# EAGLE design basestation (EAGLE 6.6.0)
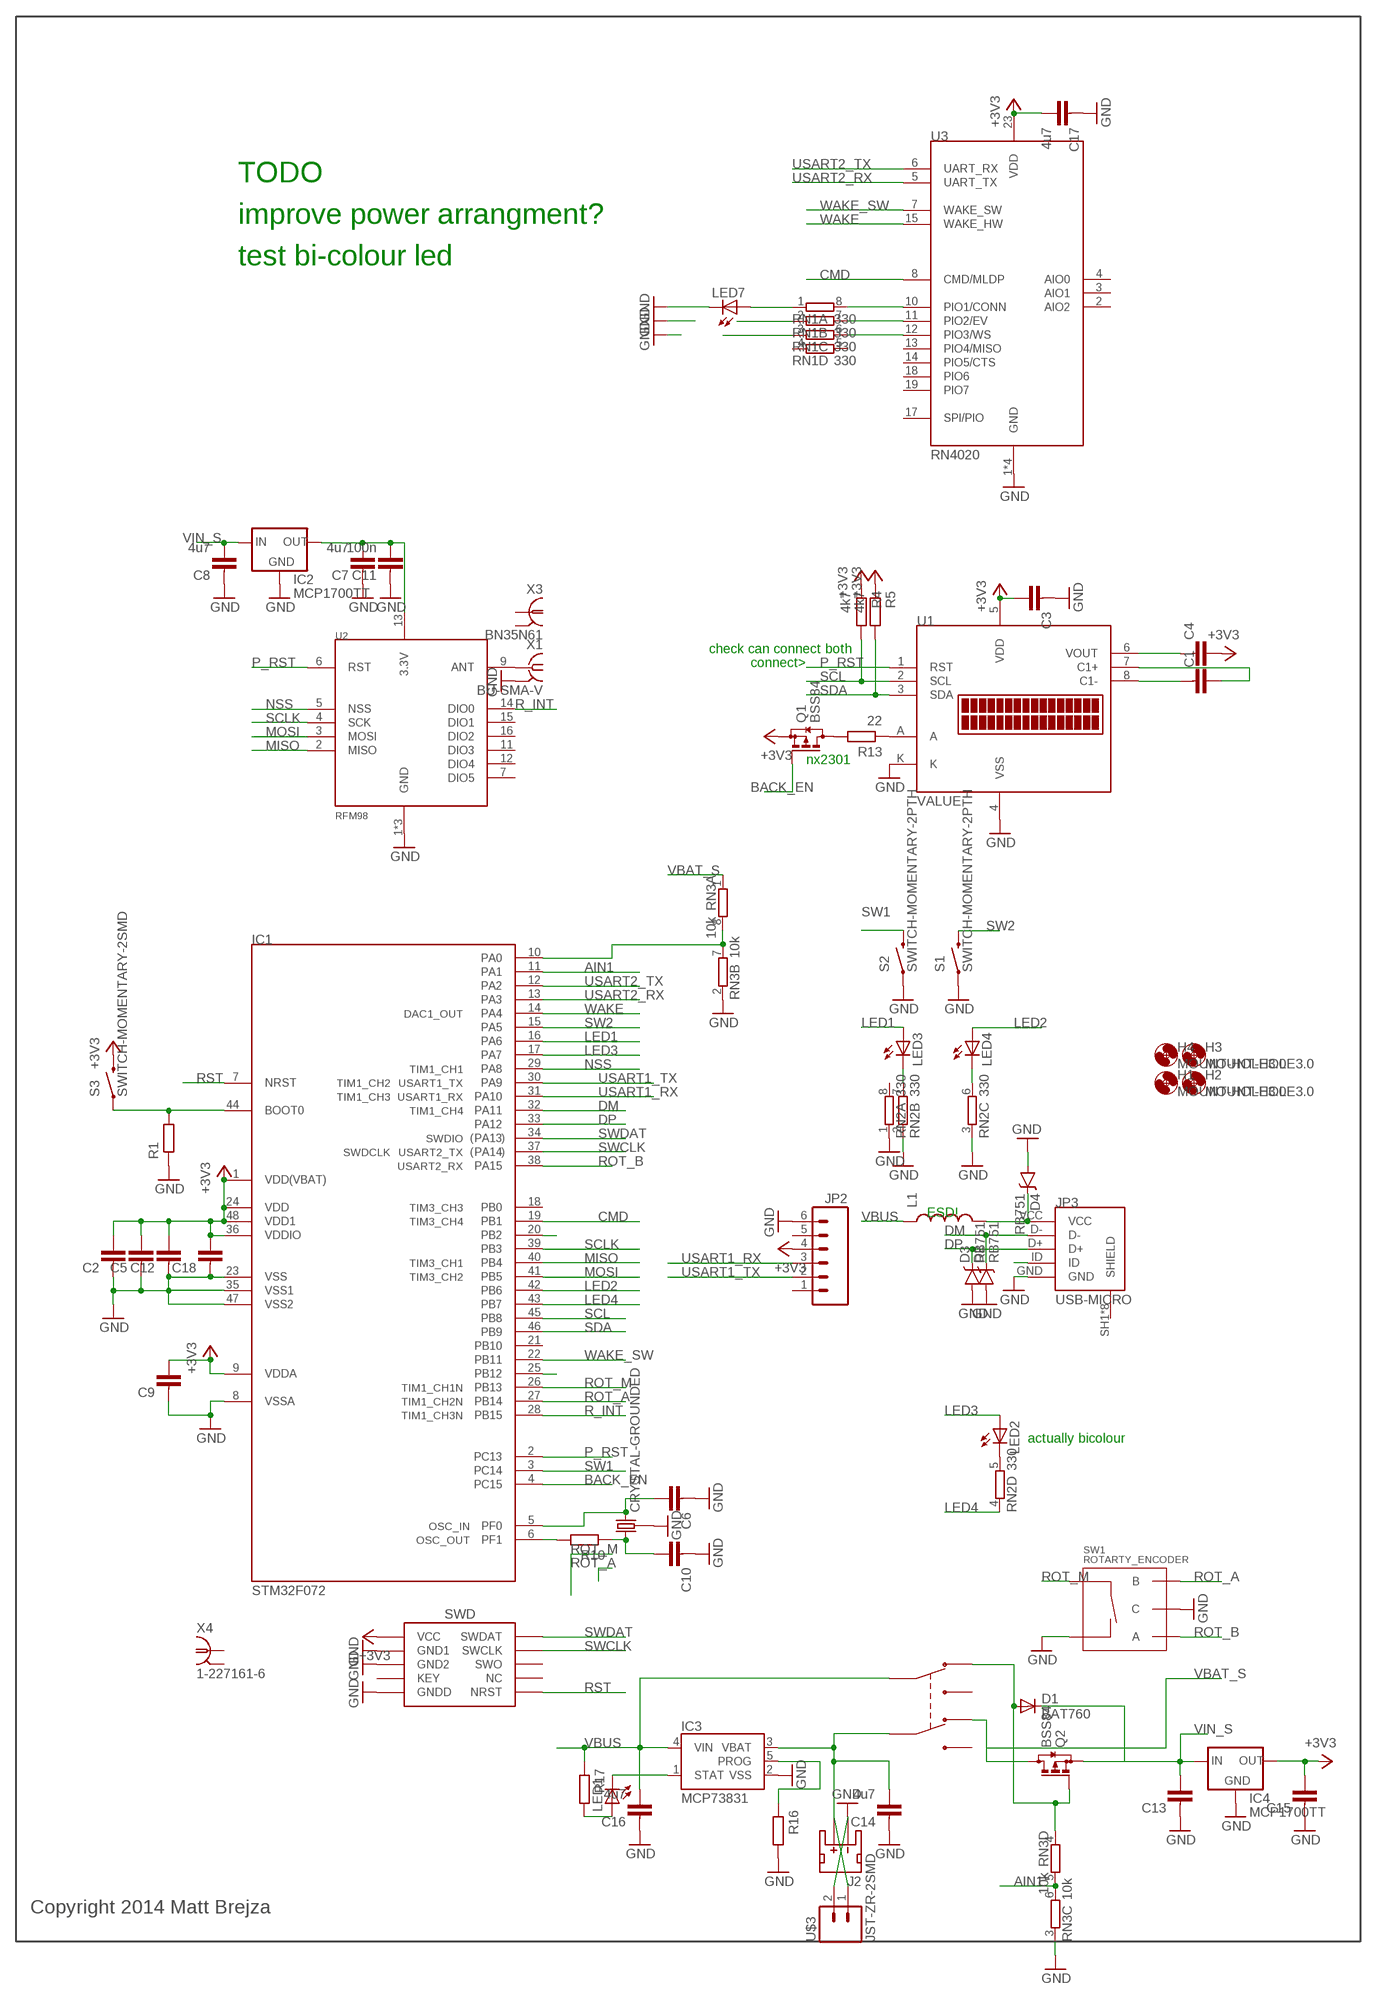
[diagram p0: schematic, sheet 1]

## Parts
C1  CAPACITOR0603-N  [C0603-N]
C2  CAPACITOR0603-N  [C0603-N]
C3  CAPACITOR0603-N  [C0603-N]
C4  CAPACITOR0603-N  [C0603-N]
C5  CAPACITOR0603-N  [C0603-N]
C6  CAPACITOR0603-N  [C0603-N]
C7  4u7  CAPACITOR0603-N  [C0603-N]
C8  4u7  CAPACITOR0603-N  [C0603-N]
C9  CAPACITOR0603-N  [C0603-N]
C10  CAPACITOR0603-N  [C0603-N]
C11  100n  CAPACITOR0603-N  [C0603-N]
C12  CAPACITOR0603-N  [C0603-N]
C13  CAPACITOR0603-N  [C0603-N]
C14  4u7  CAPACITOR0603-N  [C0603-N]
C15  CAPACITOR0603-N  [C0603-N]
C16  4u7  CAPACITOR0603-N  [C0603-N]
C17  4u7  CAPACITOR0603-N  [C0603-N]
C18  CAPACITOR0603-N  [C0603-N]
D1  BAT760  DIODE-SOD323-R  [SOD323-R]
D2  RB751  [SOD-523]
D3  RB751  [SOD-523]
D4  RB751  [SOD-523]
H1  MOUNT-HOLE3.0  [3,0]
H2  MOUNT-HOLE3.0  [3,0]
H3  MOUNT-HOLE3.0  [3,0]
H4  MOUNT-HOLE3.0  [3,0]
IC1  STM32F072  [TQFP48]
IC2  MCP1700TT  [SOT23]
IC3  MCP73831  [SOT23-5]
IC4  MCP1700TT  [SOT23]
J1  SWD_SHROUD_SMD  [SWD_SMD_SHROUD]
J2  JST_2MM_MALE  [JST-2-SMD]
JP2  M06SMD  [1X06-SMD]
JP3  USB-MICRO  [MOLEX_47589-0001]
L1  INDUCTOR0603  [0603]
LED1  LEDCHIP-LED0805  [CHIP-LED0805]
LED2  LED5MM  [LED5MM]
LED3  LED3MM  [LED3MM]
LED4  LED3MM  [LED3MM]
LED7  LEDCHIP-LED0805  [CHIP-LED0805]
Q1  BSS84  [SOT23]
Q2  BSS84  [SOT23]
R1  RESISTOR0603-N  [R0603-N]
R4  4k7  RESISTOR0603-N  [R0603-N]
R5  4k7  RESISTOR0603-N  [R0603-N]
R10  RESISTOR0603-N  [R0603-N]
R13  22  RESISTOR0603-N  [R0603-N]
R16  RESISTOR0603-N  [R0603-N]
R17  RESISTOR0603-N  [R0603-N]
RN1  330  4R-NEXB38V  [EXB38V]
RN2  330  4R-NEXB38V  [EXB38V]
RN3  10k  4R-NEXB38V  [EXB38V]
S1  SWITCH-MOMENTARY-2PTH  [TACTILE-PTH]
S2  SWITCH-MOMENTARY-2PTH  [TACTILE-PTH]
S3  SWITCH-MOMENTARY-2SMD  [TACTILE_SWITCH_SMD]
SW1  ROTARTY_ENCODER  [ROTARY_ENC_PLAIN]
U1  NHD-C0216CIZ-FSW  [NHD-C0216CIZ-FSW]
U2  RFM98  [RFM97]
U3  RN4020  [RN4020]
U$1  DPDTSLIDE  [DPDTSLIDE]
U$3  JST-ZR-2SMD  [JST-ZR-2-SMD]
X1  BU-SMA-V  [BU-SMA-V]
X2  CRYSTAL-GROUNDED  [CRYSTAL-SMD-5X3]
X3  BN35N61  [B35N61]
X4  1-227161-6  [AMP_227161]

## Nets
3.3V: C7.2 C11.2 IC2.2(OUT) U2.13(3.3V)
+3V3: C2.2 C3.2 C4.2 C5.2 C9.2 C12.2 C15.2 C17.2 C18.2 IC1.1(VDD(VBAT)) IC1.9(VDDA) IC1.24(VDD) IC1.36(VDDIO) IC1.48(VDD1) IC4.2(OUT) J1.1(VCC) JP2.4 Q1.2(S) R4.1 R5.1 S3.3 U1.5(VDD) U3.23(VDD)
AIN1: IC1.11(PA1) RN3.5 RN3.6
BACK_EN: IC1.4(PC15) Q1.1(G)
CMD: IC1.19(PB1) U3.8(CMD/MLDP)
DM: D2.C IC1.32(PA11) JP3.D-
DP: D3.C IC1.33(PA12) JP3.D+
GND: C2.1 C3.1 C5.1 C6.1 C7.1 C8.1 C9.1 C10.1 C11.1 C12.1 C13.1 C14.1 C15.1 C16.1 C17.1 C18.1 D2.A D3.A D4.A IC1.8(VSSA) IC1.23(VSS) IC1.35(VSS1) IC1.47(VSS2) IC2.1(GND) IC3.2(VSS) IC4.1(GND) J1.3(GND1) J1.5(GND2) J1.9(GNDD) J2.1(-) JP2.6 JP3.GND LED7.C R1.1 R16.2 RN2.1 RN2.2 RN2.3 RN3.2 RN3.3 S1.1 S2.1 SW1.C SW1.SW- U1.4(VSS) U1.K U2.1(GND) U2.8(GND) U2.10(GND) U3.1(GND) U3.9(GND) U3.16(GND) U3.24(GND) U$3.2 X1.2 X1.3 X1.4 X1.5 X2.2 X2.4
LED1: IC1.16(PA6) LED3.A
LED2: IC1.42(PB6) LED4.A
LED3: IC1.17(PA7) LED2.A
LED4: IC1.43(PB7) RN2.4
MISO: IC1.40(PB4) U2.2(MISO)
MOSI: IC1.41(PB5) U2.3(MOSI)
N$1: U2.9(ANT) X1.1
N$3: Q1.3(D) R13.2
N$4: IC1.44(BOOT0) R1.2 S3.1
N$5: RN1.8 U3.10(PIO1/CONN)
N$6: LED3.K(C) RN2.7
N$7: IC3.5(PROG) R16.1
N$8: C1.1 U1.8(C1-)
N$9: C1.2 U1.7(C1+)
N$10: LED4.K(C) RN2.6
N$11: LED2.K(C) RN2.5
N$12: C4.1 U1.6(VOUT)
N$13: RN1.7 U3.11(PIO2/EV)
N$14: RN1.6 U3.12(PIO3/WS)
N$15: LED7.A RN1.1
N$16: RN1.2
N$17: RN1.3
N$21: IC1.25(PB12)
N$23: R13.1 U1.A
N$25: IC1.20(PB2)
N$26: D1.A Q2.1(G) RN3.4 U$1.1A(NC0)
N$27: IC1.10(PA0) RN3.7 RN3.8
N$28: JP3.ID
N$29: IC3.1(STAT) LED1.C
N$30: IC1.6(PF1) R10.2
N$31: C6.2 IC1.5(PF0) X2.1
N$32: C10.2 R10.1 X2.3
N$33: C14.2 IC3.3(VBAT) J2.2(+) U$1.2X(COM1) U$3.1
N$34: LED1.A R17.2
N$35: D4.C JP3.VCC L1.2
NSS: IC1.29(PA8) U2.5(NSS)
P_RST: IC1.2(PC13) U1.1(RST) U2.6(RST)
R_INT: IC1.28(PB15) U2.14(DIO0)
ROT_A: IC1.27(PB14) SW1.B
ROT_B: IC1.38(PA15) SW1.A
ROT_M: IC1.26(PB13) SW1.SW+
RST: IC1.7(NRST) J1.10(NRST)
SCL: IC1.45(PB8) R4.2 U1.2(SCL)
SCLK: IC1.39(PB3) U2.4(SCK)
SDA: IC1.46(PB9) R5.2 U1.3(SDA)
SW1: IC1.3(PC14) S2.3
SW2: IC1.15(PA5) S1.3
SWCLK: IC1.37(PA14) J1.4(SWCLK)
SWDAT: IC1.34(PA13) J1.2(SWDAT)
USART1_RX: IC1.31(PA10) JP2.3
USART1_TX: IC1.30(PA9) JP2.2
USART2_RX: IC1.13(PA3) U3.5(UART_TX)
USART2_TX: IC1.12(PA2) U3.6(UART_RX)
VBAT_S: Q2.3(D) RN3.1 U$1.2A(NC1)
VBUS: C16.2 IC3.4(VIN) L1.1 R17.1 U$1.1X(COM0)
VIN_S: C8.2 C13.2 D1.C IC2.3(IN) IC4.3(IN) Q2.2(S)
WAKE: IC1.14(PA4) U3.15(WAKE_HW)
WAKE_SW: IC1.22(PB11) U3.7(WAKE_SW)
Unconnected: IC1.18(PB0) IC1.21(PB10) J1.6(SWO) J1.7(KEY) J1.8(NC) J2.NC1(PAD1) J2.NC2(PAD2) JP2.1 JP2.5 JP3.SH1(SHIELD) JP3.SH2(SHIELD) JP3.SH3(SHIELD) JP3.SH4(SHIELD) JP3.SH5(SHIELD) JP3.SH6(SHIELD) JP3.SH7(SHIELD) JP3.SH8(SHIELD) RN1.4 RN1.5 RN2.8 U2.7(DIO5) U2.11(DIO3) U2.12(DIO4) U2.15(DIO1) U2.16(DIO2) U3.2(AIO2) U3.3(AIO1) U3.4(AIO0) U3.13(PIO4/MISO) U3.14(PIO5/CTS) U3.17(SPI/PIO) U3.18(PIO6) U3.19(PIO7) U$1.1B(NO0) U$1.2B(NO1) X3.1 X3.2 X3.3 X3.4 X3.5 X4.1 X4.2

## Notes on the sheet
- TODO
- improve power arrangment?
- test bi-colour led
- check can connect both
- connect>
- nx2301
- ESD!
- actually bicolour
- Copyright 2014 Matt Brejza

## Library data of the parts
C1-C18 = passives-7351:CAPACITOR
D1 = dtb:DIODE-: DIODE
D2-D4 = SparkFun-DiscreteSemi:RB751: 40V 120mA SOD-523 Schottky DIO-11018; PROD_ID: DIO-11018
H1-H4 = Mounting:MOUNT-HOLE: MOUNTING HOLE with drill center marker
IC1 = dtb:STM32F072
IC2 IC4 = dtb:MCP1700
IC3 = SparkFun-PowerIC:MCP73831: Miniature single cell, fully integrated Li-Ion, Li-polymer charge management controller http://ww1.microchip.com/downloads/en/DeviceDoc/21984a.pdf IC-09995; PROD_ID: IC-09995
J1 = dtb:SWD_SHROUD
J2 = dtb:JST_2MM_MALE: Mates to single-cell LiPo batteries. CONN-08352; PROD_ID: CONN-08352
JP2 = SparkFun-Connectors:M06: Header 6 Standard 6-pin 0.1" header. Use with straight break away headers (SKU : PRT-00116), right angle break away headers (PRT-00553), swiss pins (PRT-00743), machine pins (PRT-00117), and female headers (PRT-00115). Molex polarized connector foot print use with SKU : PRT-08094 with associated crimp pins and housings. NOTES ON THE VARIANTS LOCK and LOCK_LONGPADS... This footprint was designed to help hold the alignment of a through-hole component (i.e. 6-pin header) while soldering it into place. You may notice that each hole has been shifted either up or down by 0.005 of an inch from it's more standard position (which is a perfectly straight line). This slight alteration caused the pins (the squares in the middle) to touch the edges of the holes. Because they are alternating, it causes a "brace" to hold the component in place. 0.005 has proven to be the perfect amount of "off-center" position when using our standard breakaway headers. Although looks a little odd when you look at the bare footprint, once you have a header in there, the alteration is very hard to notice. Also,if you push a header all the way into place, it is covered up entirely on the bottom side. This idea of altering the position of holes to aid alignment will be further integrated into the Sparkfun Library for other footprints. It can help hold any component with 3 or more connection pins.
JP3 = Mine:USB-MICRO
L1 = SparkFun-Passives:INDUCTOR: Inductors Basic Inductor/Choke - 0603 and 1206. Footprints are not proven and vary greatly between part numbers. SRN6045- 33uH, 20% 1.4A SDR0403-560KL - 56uH, 10%, 500mA RMS/740mA peak
LED1 LED2 LED7 = led:LED: LED OSRAM: - CHIPLED LG R971, LG N971, LY N971, LG Q971, LY Q971, LO R971, LY R971 LH N974, LH R974 LS Q976, LO Q976, LY Q976 LO Q996 - Hyper CHIPLED LW Q18S LB Q993, LB Q99A, LB R99A - SideLED LS A670, LO A670, LY A670, LG A670, LP A670 LB A673, LV A673, LT A673, LW A673 LH A674 LY A675 LS A676, LA A676, LO A676, LY A676, LW A676 LS A679, LY A679, LG A679 - Hyper Micro SIDELED® LS Y876, LA Y876, LO Y876, LY Y876 LT Y87S - SmartLED LW L88C, LW L88S LB L89C, LB L89S, LG L890 LS L89K, LO L89K, LY L89K LS L896, LA L896, LO L896, LY L896 - TOPLED LS T670, LO T670, LY T670, LG T670, LP T670 LSG T670, LSP T670, LSY T670, LOP T670, LYG T670 LG T671, LOG T671, LSG T671 LB T673, LV T673, LT T673, LW T673 LH T674 LS T676, LA T676, LO T676, LY T676, LB T676, LH T676, LSB T676, LW T676 LB T67C, LV T67C, LT T67C, LS T67K, LO T67K, LY T67K, LW E67C LS E67B, LA E67B, LO E67B, LY E67B, LB E67C, LV E67C, LT E67C LW T67C LS T679, LY T679, LG T679 LS T770, LO T770, LY T770, LG T770, LP T770 LB T773, LV T773, LT T773, LW T773 LH T774 LS E675, LA E675, LY E675, LS T675 LS T776, LA T776, LO T776, LY T776, LB T776 LHGB T686 LT T68C, LB T68C - Hyper Mini TOPLED® LB M676 - Mini TOPLED Santana® LG M470 LS M47K, LO M47K, LY M47K Source: http://www.osram.convergy.de LUXEON: - LUMILED® LXK2-PW12-R00, LXK2-PW12-S00, LXK2-PW14-U00, LXK2-PW14-V00 LXK2-PM12-R00, LXK2-PM12-S00, LXK2-PM14-U00 LXK2-PE12-Q00, LXK2-PE12-R00, LXK2-PE12-S00, LXK2-PE14-T00, LXK2-PE14-U00 LXK2-PB12-K00, LXK2-PB12-L00, LXK2-PB12-M00, LXK2-PB14-N00, LXK2-PB14-P00, LXK2-PB14-Q00 LXK2-PR12-L00, LXK2-PR12-M00, LXK2-PR14-Q00, LXK2-PR14-R00 LXK2-PD12-Q00, LXK2-PD12-R00, LXK2-PD12-S00 LXK2-PH12-R00, LXK2-PH12-S00 LXK2-PL12-P00, LXK2-PL12-Q00, LXK2-PL12-R00 Source: www.luxeon.com KINGBRIGHT: KA-3528ASYC Source: www.kingbright.com
LED3 LED4 = dtb:LED: LED OSRAM: - CHIPLED LG R971, LG N971, LY N971, LG Q971, LY Q971, LO R971, LY R971 LH N974, LH R974 LS Q976, LO Q976, LY Q976 LO Q996 - Hyper CHIPLED LW Q18S LB Q993, LB Q99A, LB R99A - SideLED LS A670, LO A670, LY A670, LG A670, LP A670 LB A673, LV A673, LT A673, LW A673 LH A674 LY A675 LS A676, LA A676, LO A676, LY A676, LW A676 LS A679, LY A679, LG A679 - Hyper Micro SIDELED® LS Y876, LA Y876, LO Y876, LY Y876 LT Y87S - SmartLED LW L88C, LW L88S LB L89C, LB L89S, LG L890 LS L89K, LO L89K, LY L89K LS L896, LA L896, LO L896, LY L896 - TOPLED LS T670, LO T670, LY T670, LG T670, LP T670 LSG T670, LSP T670, LSY T670, LOP T670, LYG T670 LG T671, LOG T671, LSG T671 LB T673, LV T673, LT T673, LW T673 LH T674 LS T676, LA T676, LO T676, LY T676, LB T676, LH T676, LSB T676, LW T676 LB T67C, LV T67C, LT T67C, LS T67K, LO T67K, LY T67K, LW E67C LS E67B, LA E67B, LO E67B, LY E67B, LB E67C, LV E67C, LT E67C LW T67C LS T679, LY T679, LG T679 LS T770, LO T770, LY T770, LG T770, LP T770 LB T773, LV T773, LT T773, LW T773 LH T774 LS E675, LA E675, LY E675, LS T675 LS T776, LA T776, LO T776, LY T776, LB T776 LHGB T686 LT T68C, LB T68C - Hyper Mini TOPLED® LB M676 - Mini TOPLED Santana® LG M470 LS M47K, LO M47K, LY M47K Source: http://www.osram.convergy.de LUXEON: - LUMILED® LXK2-PW12-R00, LXK2-PW12-S00, LXK2-PW14-U00, LXK2-PW14-V00 LXK2-PM12-R00, LXK2-PM12-S00, LXK2-PM14-U00 LXK2-PE12-Q00, LXK2-PE12-R00, LXK2-PE12-S00, LXK2-PE14-T00, LXK2-PE14-U00 LXK2-PB12-K00, LXK2-PB12-L00, LXK2-PB12-M00, LXK2-PB14-N00, LXK2-PB14-P00, LXK2-PB14-Q00 LXK2-PR12-L00, LXK2-PR12-M00, LXK2-PR14-Q00, LXK2-PR14-R00 LXK2-PD12-Q00, LXK2-PD12-R00, LXK2-PD12-S00 LXK2-PH12-R00, LXK2-PH12-S00 LXK2-PL12-P00, LXK2-PL12-Q00, LXK2-PL12-R00 Source: www.luxeon.com KINGBRIGHT: KA-3528ASYC Source: www.kingbright.com
Q1 Q2 = transistor-small-signal:BSS84: P-CHANNEL MOS FET
R1 R4 R5 R10 R13 R16 R17 = passives-7351:RESISTOR
RN1-RN3 = resistor-dil:4R-N: Array Chip Resistor Source: RS Component / Phycomp; OC_FARNELL: unknown; OC_NEWARK: unknown
S1-S3 = Mine:SWITCH-MOMENTARY-2: Various NO switches- pushbuttons, reed, etc
SW1 = SparkFun-Electromechanical:ROTARTY_ENCODER: Simple no LED rotary encoder Example: COM-09117
U1 = dtb:NHD-C0216CIZ-FSW
U2 = Mine:RFM98
U3 = Mine:RN4020
U$1 = Mine:DPDTSLIDE
U$3 = Mine:JST-ZR-2
X1 = con-coax:BU-SMA-V: FEMALE SMA CONNECTOR Radiall distributor RS 112-3794; OC_FARNELL: unknown; OC_NEWARK: unknown
X2 = SparkFun-FreqCtrl:CRYSTAL-GROUNDED
X3 = con-coax:BN35N61: BNC CONNECTOR M/A COM www.macom.com distributor Farnell 149-452; OC_FARNELL: unknown; OC_NEWARK: unknown
X4 = con-coax:?227161*: JACK, RIGHT ANGLE, 50 OHM, PCB, BNC Source: amp_227161.pdf; MF: TYCO ELECTRONICS; MPN: 1-227161-6; OC_FARNELL: unknown; OC_NEWARK: 09H7854

## Board
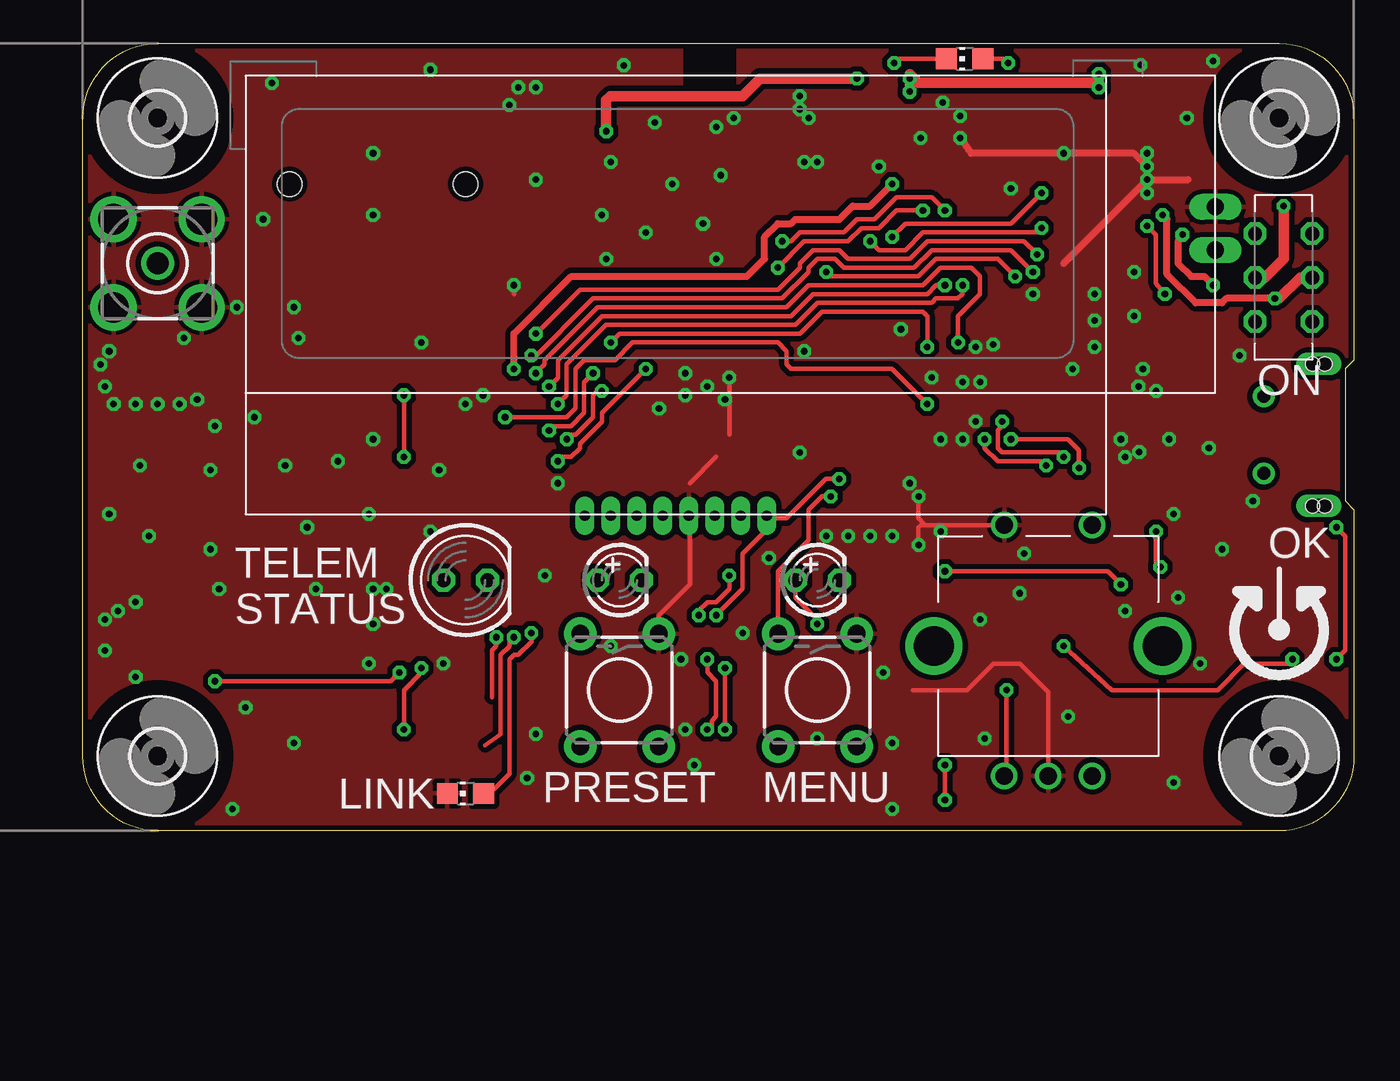
[diagram p1: board, top side]
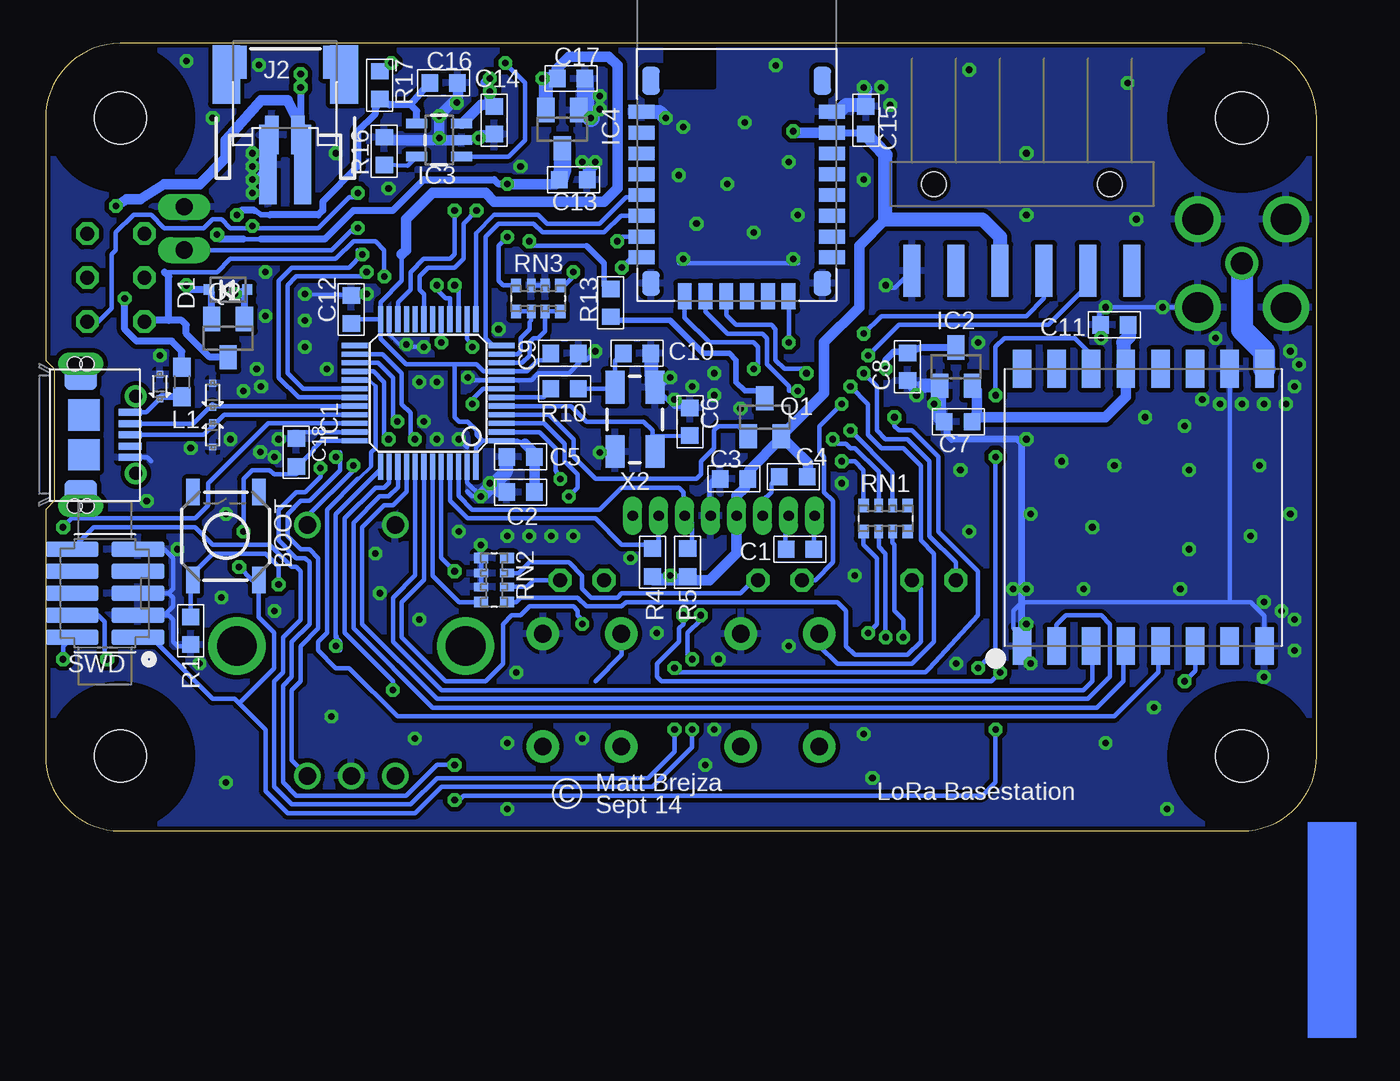
[diagram p2: board, bottom side, seen from below]

Size 73.41 x 45.47 mm. Coordinates in mm from the lower left corner, seen from the top.
Outline: 4.32,45.47 69.09,45.47 arc-90 73.41,41.15 73.41,27.18 72.9,26.67 72.9,19.05 73.41,18.54 73.41,4.32 arc-90 69.09,0 4.32,0 arc-90 0,4.32 0,41.15 arc-90 4.32,45.47
Copper layers (1*16): Top 0.035mm / dielectric 1.5mm / Bottom 0.035mm
Design rules "default *": minimum track width 0.2mm, minimum drill 15mil, track to track 8mil, track to pad 8mil, pad to pad 6mil, via to via 8mil, smd to smd 6mil, copper to edge 10mil, drill to drill 8mil, minimum pad ring 10mil, minimum via ring 8mil, stop-mask expansion 4mil, vias tented up to drill 15mil, thermal gap 10mil
tKeepout: area 35.1,43.2 to 37.3,45

### Footprints (pad centres in the part's own frame; a part is rotated, then mirrored left to right if it is on the bottom)
C0603-N = smd 0.95 x 1: 1 -0.8,0; 2 0.8,0
SOD323-R = smd 0.6 x 0.6: A 1.1,0; C -1.1,0
SOD-523 = smd 0.4 x 0.4: A -0.7,0; C 0.7,0
3,0 = hole 3: 0,0
TQFP48 = smd 0.3 x 1.5: 1 -2.75,-4.25; 2 -2.25,-4.25; 3 -1.75,-4.25; 4 -1.25,-4.25; 5 -0.75,-4.25; 6 -0.25,-4.25; 7 0.25,-4.25; 8 0.75,-4.25; 9 1.25,-4.25; 10 1.75,-4.25; 11 2.25,-4.25; 12 2.75,-4.25; 25 2.75,4.25; 26 2.25,4.25; 27 1.75,4.25; 28 1.25,4.25; 29 0.75,4.25; 30 0.25,4.25; 31 -0.25,4.25; 32 -0.75,4.25; 33 -1.25,4.25; 34 -1.75,4.25; 35 -2.25,4.25; 36 -2.75,4.25 | smd 1.5 x 0.3: 13 4.25,-2.75; 14 4.25,-2.25; 15 4.25,-1.75; 16 4.25,-1.25; 17 4.25,-0.75; 18 4.25,-0.25; 19 4.25,0.25; 20 4.25,0.75; 21 4.25,1.25; 22 4.25,1.75; 23 4.25,2.25; 24 4.25,2.75; 37 -4.25,2.75; 38 -4.25,2.25; 39 -4.25,1.75; 40 -4.25,1.25; 41 -4.25,0.75; 42 -4.25,0.25; 43 -4.25,-0.25; 44 -4.25,-0.75; 45 -4.25,-1.25; 46 -4.25,-1.75; 47 -4.25,-2.25; 48 -4.25,-2.75
SOT23 = smd 1 x 1.4: 1 -0.95,-1.1; 2 0.95,-1.1; 3 0,1.1
SOT23-5 = smd 0.55 x 1.2: 1 -0.95,-1.3; 2 0,-1.3; 3 0.95,-1.3; 4 0.95,1.3; 5 -0.95,1.3
SWD_SMD_SHROUD = smd 0.914 x 3.048: 1 -2.54,-1.905; 2 -2.54,1.905; 3 -1.27,-1.905; 4 -1.27,1.905; 5 0,-1.905; 6 0,1.905; 7 1.27,-1.905; 8 1.27,1.905; 9 2.54,-1.905; 10 2.54,1.905
JST-2-SMD = smd 1 x 4.6: 1 -1,-3.7; 2 1,-3.7 | smd 1.6 x 3.4: NC1 -3.4,1.5; NC2 3.4,1.5
1X06-SMD = smd 1 x 3: 1 -6.35,5; 2 -3.81,5; 3 -1.27,5; 4 1.27,5; 5 3.81,5; 6 6.35,5 | hole 1.4: -5.08,0; 5.08,0
MOLEX_47589-0001 = smd 1.35 x 0.4: D+ 2.855,0; D- 2.855,0.652; GND 2.855,-1.3; ID 2.855,-0.65; VCC 2.855,1.3 | smd 1.8 x 1.8: SH1 0.18,1.15; SH2 0.18,-1.15 | drill 0.75 pad 1.15: SH3 3.18,-2.225; SH4 3.18,2.225 | smd 1.9 x 2.1: SH5 0,3.65; SH6 0,-3.65 | drill 0.8 pad 1.2 long: SH7 0,-4.1; SH8 0,4.1 | hole 0.8: -0.35,-4.1; 0.35,-4.1; -0.35,4.1; 0.35,4.1
0603 = smd 1.1 x 1: 1 -0.85,0; 2 0.85,0
CHIP-LED0805 = smd 1.2 x 1.2: A 0,-1.05; C 0,1.05
LED5MM = drill 0.813 octagon: A -1.27,0; K 1.27,0
LED3MM = drill 0.813 octagon: A -1.27,0; K 1.27,0
R0603-N = smd 0.95 x 1: 1 -0.8,0; 2 0.8,0
EXB38V = smd 0.6 x 0.8: 1 -1.275,-0.75; 4 1.275,-0.75; 5 1.275,0.75; 8 -1.275,0.75 | smd 0.5 x 0.8: 2 -0.4,-0.75; 3 0.4,-0.75; 6 0.4,0.75; 7 -0.4,0.75
TACTILE-PTH = drill 1.016 pad 1.88: 1 -3.251,2.261; 2 3.251,2.261; 3 -3.251,-2.261; 4 3.251,-2.261
TACTILE_SWITCH_SMD = smd 1.524 x 0.762: 1 -2.54,1.905; 2 2.54,1.905; 3 -2.54,-1.905; 4 2.54,-1.905
ROTARY_ENC_PLAIN = drill 1.016: A 7.493,-2.54; B 7.493,2.54; C 7.493,0; SW+ -6.985,2.54; SW- -6.985,-2.54 | drill 2.286: P$3 0,6.604; P$4 0,-6.604
NHD-C0216CIZ-FSW = drill 0.6 long: 1 30.1,-0.1; 2 28.6,-0.1; 3 27.1,-0.1; 4 25.6,-0.1; 5 24.1,-0.1; 6 22.6,-0.1; 7 21.1,-0.1; 8 19.6,-0.1 | drill 1 pad 1.27 long: A 56,15.24; K 56,17.74
RFM97 = smd 2.184 x 1.067: 1 0,0; 2 0,-2; 3 0,-4; 4 0,-6; 5 0,-8; 6 0,-10; 7 0,-12; 8 0,-14; 9 16,-14; 10 16,-12; 11 16,-10; 12 16,-8; 13 16,-6; 14 16,-4; 15 16,-2; 16 16,0
RN4020 = smd 1.5 x 0.8: 1 0.25,10.9; 2 0.25,9.7; 3 0.25,8.5; 4 0.25,7.3; 5 0.25,6.1; 6 0.25,4.9; 7 0.25,3.7; 8 0.25,2.5; 17 11.25,2.5; 18 11.25,3.7; 19 11.25,4.9; 20 11.25,6.1; 21 11.25,7.3; 22 11.25,8.5; 23 11.25,9.7; 24 11.25,10.9 | smd 1 x 1.4: 9 0.8,1; 16 10.7,1 | smd 0.8 x 1.5: 10 2.75,0.25; 11 3.95,0.25; 12 5.15,0.25; 13 6.35,0.25; 14 7.55,0.25; 15 8.75,0.25 | smd 1 x 1.6: S1 0.8,12.7; S2 10.7,12.7
DPDTSLIDE = drill 0.8 octagon: 1A -2.54,0; 1B 2.54,0; 1X 0,0; 2A -2.54,3.3; 2B 2.54,3.3; 2X 0,3.3
JST-ZR-2-SMD = smd 0.8 x 2.2: 1 0.6,-1.1; 2 -0.9,-1.1 | smd 1.1 x 1.9: TB1 -2.9,3.1; TB2 2.6,3.1
BU-SMA-V = drill 1.27: 1 0,0 | drill 1.778: 2 -2.55,2.55; 3 2.55,2.55; 4 2.55,-2.55; 5 -2.55,-2.55
CRYSTAL-SMD-5X3 = smd 1.9 x 1.1: 1 -1.85,-1.15; 2 1.85,-1.15; 3 1.85,1.15; 4 -1.85,1.15
B35N61 = drill 1.2: 1 0,0 | drill 1.3: 2 3.099,3.099; 3 -3.099,3.099; 4 -3.099,-3.099; 5 3.099,-3.099
AMP_227161 = drill 0.9 pad 1.27: 1 0,-5.08; 2 -2.54,-5.08 | hole 2: -5.08,0; 5.08,0

### Placement (x,y rotation side)
C1  29.84,16.26 180 bottom
C2  45.97,19.56 0 bottom
C3  33.66,20.32 0 bottom
C4  30.23,20.45 0 bottom
C5  45.97,21.59 0 bottom
C6  36.2,23.62 270 bottom
C7  20.7,23.62 0 bottom
C8  23.62,26.8 90 bottom
C9  43.43,27.56 180 bottom
C10  39.24,27.56 180 bottom
C11  11.68,29.21 0 bottom
C12  55.75,30.1 270 bottom
C13  42.93,37.59 180 bottom
C14  47.5,41.02 90 bottom
C15  26.04,41.02 270 bottom
C16  50.42,43.18 180 bottom
C17  43.05,43.43 180 bottom
C18  58.93,21.84 270 bottom
D1  62.87,31.24 0 bottom
D2  63.75,25.15 270 bottom
D3  63.75,22.86 90 bottom
D4  66.8,25.65 270 bottom
H1  4.32,41.15 0 top
H2  69.09,41.15 0 top
H3  4.32,4.32 0 top
H4  69.09,4.32 0 top
IC1  51.31,25.27 90 bottom
IC2  20.83,26.8 0 bottom
IC3  50.67,39.88 90 bottom
IC4  43.56,40.51 180 bottom
J1  69.98,13.72 90 bottom
J2  59.56,42.16 0 bottom
JP2  17.02,37.34 180 bottom
JP3  71.37,22.86 0 bottom
L1  65.53,25.91 270 bottom
LED1  50.93,44.58 90 top
LED2  22.1,14.48 0 top
LED3  30.99,14.48 0 top
LED4  42.42,14.48 0 top
LED7  22.1,2.16 90 top
Q1  31.88,23.88 0 bottom
Q2  62.87,28.45 180 bottom
R1  65.02,11.56 90 bottom
R4  38.35,15.49 90 bottom
R5  36.32,15.49 90 bottom
R10  43.43,25.53 180 bottom
R13  40.77,30.48 270 bottom
R16  53.85,39.24 90 bottom
R17  54.1,43.05 90 bottom
RN1  24.89,18.03 0 bottom
RN2  47.5,14.48 270 bottom
RN3  44.96,30.73 180 bottom
S1  30.99,8.13 270 top
S2  42.42,8.13 270 top
S3  62.99,17.02 90 bottom
SW1  55.75,10.67 270 top
U1  9.4,18.29 0 top
U2  17.02,10.67 90 bottom
U3  39.24,30.61 0 bottom
U$1  70.99,31.94 90 top
U$3  59.44,41.28 0 bottom
X1  4.32,32.77 0 top
X2  39.37,23.75 90 bottom
X3  -22.35,4.83 0 top  (outside the outline)
X4  -47.75,-2.54 0 top  (outside the outline)

### Tracks (layer width: path | path; a pad name or v marks a point on that pad's centre or on a via)
3.3V
  Bottom 0.254: IC2.2 19.62,25.4 19.88,23.65 C7.2
  Bottom 0.61: U2.13 11.02,25.05 12.19,23.88 19.62,23.88 19.62,25.4
  Bottom 0.813: C11.2 10.83,28.54 11.18,28.19 11.18,26.83 U2.13
+3V3  (via drill 0.38)
  Top 0.254: v36.07,9.91 36.07,9.14 36.58,8.64 36.58,6.6 36.32,6.35 36.32,6.1 v36.07,5.84 | v35.56,12.45 35.56,12.7 36.07,13.21 36.58,13.21 37.34,13.97 v37.34,14.73 | v61.98,17.27 61.98,15.49 v62.23,15.24
  Top 0.61: v30.23,40.39 30.23,42.16 30.48,42.42 38.1,42.42 39.12,43.43 v44.7,43.43
  Bottom 0.254: 44.96,20.92 C5.2 | C9.2 44.66,27.18 44.96,27.18 45.61,26.52 IC1.9 48.11,26.52 48.51,26.92 49.78,26.92 | C15.2 26.04,40.01 25.91,40.13 | IC1.24 55.73,29.52 C12.2 | 49.78,26.92 52.58,26.92 54.06,28.4 IC1.24 | 48.18,22.52 IC1.1 46.15,22.52 45.72,22.35 | 48.18,22.52 48.51,22.86 48.51,23.11 49.02,23.62 49.53,23.62 49.78,23.88 49.78,26.92 | IC1.48 48.56,22.14 48.18,22.52 | R4.1 38.35,14.73 v37.34,14.73 36.32,14.73 | v36.07,5.84 36.07,4.83 38.35,2.54 50.55,2.54 52.07,1.02 59.44,1.02 60.71,2.29 60.71,5.84 62.23,7.37 | 62.23,7.37 62.48,7.62 63.75,7.62 67.31,11.18 J1.1 | 36.11,14.73 R5.1 | C4.2 29.38,20.49 | v35.56,12.45 35.56,12.19 36.32,11.43 36.32,10.16 v36.07,9.91 | IC1.24 54.06,30.52 52.83,31.75 52.83,33.27 | 62.23,7.37 60.2,9.4 60.2,11.43 61.09,12.32 S3.3 61.47,14.48 v62.23,15.24 62.23,14.99 | 57.91,22.1 57.91,22.06 | IC1.36 57.45,22.52 57.91,22.06 | 57.91,22.06 57.91,21.97 58.67,21.21 | 58.67,21.21 58.93,20.57 60.2,20.57 60.45,20.83 61.47,20.83 61.98,20.32 v61.98,17.27 | C18.2 58.89,21.04 58.67,21.21
  Bottom 0.406: R5.1 36.32,14.73 | U3.23 26.17,40.31 C15.2
  Bottom 0.61: U3.23 30.15,40.31 v30.23,40.39 | 24.89,35.31 26.42,33.78 26.42,30.23 28.45,28.19 28.45,25.25 Q1.2 | Q1.2 30.93,22.67 32.77,20.83 32.77,20.36 C3.2 33.02,20.11 33.02,19.81 33.5,19.33 U1.5 33.5,16.03 35.05,14.48 38.32,14.48 R4.1 | 29.38,20.49 29.38,21.25 29.72,21.59 29.74,21.59 Q1.2 | C17.2 43.9,43.98 43.18,44.7 40.89,44.7 40.39,44.2 40.39,37.08 41.15,36.32 47.5,36.32 48.01,36.83 51.05,36.83 52.58,35.31 52.58,33.53 52.83,33.27 | 45.72,22.35 45.21,21.84 45.21,21.68 C5.2 C2.2
  Bottom 0.813: C15.2 24.89,39.03 24.89,35.31 19.3,35.31 18.29,34.29 JP2.4 | IC4.2 44.51,43.24 v44.7,43.43 C17.2
AIN1
  Bottom 0.254: IC1.11 46.14,27.52 45.97,27.69 45.97,28.45 45.47,28.96 45.47,29.38 45.36,29.48 RN3.6 RN3.5
BACK_EN
  Bottom 0.254: Q1.1 33.38,23.37 34.54,23.37 34.8,23.11 34.8,22.1 35.56,21.34 35.56,20.57 35.81,20.32 41.66,20.32 42.93,21.59 42.93,22.61 44.34,24.02 IC1.4
CMD  (via drill 0.38)
  Top 0.254: v48.51,35.81 46.99,35.81 45.97,34.8 44.96,34.8 44.2,34.04 41.66,34.04 v40.13,32.51
  Bottom 0.254: U3.8 39.54,33.11 v40.13,32.51 | v48.51,35.81 49.28,35.05 49.28,33.02 49.78,32.51 51.31,32.51 51.82,32 51.82,31.24 51.56,30.98 IC1.19
DM
  Bottom 0.254: IC1.32 63.68,24.52 D2.C 63.8,24.64 63.75,24.64 64.88,23.51 JP3.D-
DP
  Bottom 0.254: IC1.33 63.1,24.02 63.25,23.88 63.75,23.37 | 63.8,23.37 D3.C 63.71,23.37 63.75,23.37 | JP3.D+ 64.26,22.86 63.75,23.37
GND  (via drill 0.38)
  Top 0.254: S2.1 44.65,11.38 | S1.1 33.25,12.42 35.05,14.22 35.05,18.13 U1.4 35.05,18.24 | v37.34,26.16 37.34,22.86 | 36.58,21.59 35.05,20.07 | SW1.C 55.75,8 54.1,9.65 52.58,9.65 51.05,8.13 47.93,8.13 | SW1.SW- 48.64,17.65 | 48.64,17.65 48.26,18.03 v48.26,19.3 | 48.64,17.65 48.39,17.65 48.26,17.53 v48.26,16.51 | v24.89,31.5 24.89,30.99 | v23.11,25.15 23.11,24.89 | v30.23,33.02 30.23,32.77
  Top 0.406: v50.67,40.01 51.31,39.12 60.71,39.12 v61.47,38.35 v61.47,37.59 | v61.47,37.59 63.83,37.59 | 56.64,32.77 v61.47,37.59
  Bottom 0.2: IC1.23 53.56,28.67 52.83,27.94
  Bottom 0.254: U3.9 38.24,31.35 | 36.83,32.77 29.97,32.77 | JP2.6 24.35,31.35 24.75,31.35 v24.89,31.5 | R16.2 53.81,40.09 53.85,39.88 | 49.06,19.59 48.77,19.3 v48.26,19.3 | C9.1 42.58,27.01 43.18,26.42 44.96,26.42 45.35,26.02 IC1.8 48.88,26.02 v49.02,26.16 | 42.33,27.81 C9.1 | 22.68,25.69 C8.1 23.41,25.44 v23.11,25.15 | 21.78,23.85 C7.1 | v41.66,27.69 42.2,27.18 C9.1 | U2.8 3.02,12.42 3.81,13.21 5.08,13.21 | 5.08,13.21 17.02,13.21 17.53,12.7 17.53,11.68 17.02,11.18 | U2.10 5.02,13.27 5.08,13.21 | 48.35,16.6 v48.26,16.51 48.35,16 48.25,15.9 RN2.1 RN2.3 | 48.01,19.56 v48.26,19.3 | 68.33,13.97 68.58,13.72 J1.5 66.29,13.72 | C3.1 34.8,20.32 35.05,20.07 35.05,18.24 U1.4 | 55.71,30.99 C12.1 56.43,30.95 v58.42,30.99 56.86,30.95 | C6.1 37.09,24.47 X2.2 | 38.39,25.77 X2.2 | X2.2 37.9,25.6 v37.34,26.16 | X2.4 41.35,21.9 v41.4,21.84 | 29.96,32.77 29.97,32.77 | 29.97,32.77 v30.23,33.02 | C11.1 12.53,29.88 v12.19,30.23 X1.4 | 52.83,27.94 v51.56,27.94 | 49.06,22.13 v49.53,22.61 | J1.9 66.55,16.26 66.04,15.75 66.04,13.97 66.29,13.72 | 66.29,13.72 66.04,13.46 66.04,12.95 66.55,12.45 J1.3 66.29,12.45 66.04,12.19 66.04,10.92 65.79,10.67 65.06,10.67 R1.1 | RN3.2 RN3.3 | JP3.GND 67.53,21.56 67.31,21.34 | IC1.47 49.06,20.1 v48.26,19.3 | C18.1 58.55,23.02 IC1.35
  Bottom 0.406: U2.1 17.02,11.18 17.02,22.35 17.27,22.61 21.08,22.61 21.34,22.86 21.34,23.41 C7.1 | J2.1 61.32,37.45 v61.47,37.59 | C13.1 42.08,38.27 v42.42,38.61 42.16,38.35 42.16,37.85 41.66,38.35 v41.66,38.61 | U$3.2 60.45,40.18 60.45,39.12 v61.47,39.12 v61.47,38.35
  Bottom 0.61: C16.1 49.57,42.38 v50.67,41.28 v50.67,40.01 | 53.85,39.88 51.05,39.88 v50.67,40.01 | IC3.2 50.8,39.88 v50.67,40.01 | C14.1 48.22,40.17 v48.39,40.01 | C2.1 47.24,19.56 v47.75,20.07
  Bottom 0.813: U3.24 27.58,41.51 27.18,41.91 26.07,41.91 | 26.07,41.91 C15.1 | 26.07,41.91 26.07,42.84 v26.16,42.93 | 21.78,23.85 IC2.1 22.67,25.7 22.68,25.69 | U3.1 37.95,41.51 v37.59,41.15 | C5.1 46.82,20.74 v48.26,19.3 | 38.39,25.77 C10.1
  Bottom 1.016: C17.1 42.2,41.44 | 42.2,41.44 v41.91,41.15 | 42.2,41.44 42.44,41.44 IC4.1
  other vias: 37.08,24.89 25.15,42.93 24.64,41.91 49.66,42.04 61.47,36.83 36.58,33.02 1.27,10.41 1.27,12.19 3.05,13.21 2.03,12.7 3.05,8.89 3.05,24.64 4.32,24.64 5.59,24.64 1.78,24.64 1.27,25.65 1.02,26.92 1.52,27.69 5.84,28.45 6.6,24.89 8.89,30.23 12.45,28.45 16.76,22.61 22.1,24.64 16.76,11.94 16.76,13.97 17.53,13.97 16.51,9.65 3.81,17.02 7.37,20.83 11.68,21.08 7.37,16.26 3.3,21.08 9.91,23.88 14.73,21.34 12.95,17.53 7.87,13.97 13.46,13.97 9.4,7.11 12.19,5.08 20.83,9.65 30.48,10.67 34.54,9.91 34.8,5.84 26.16,5.59 46.74,5.08 56.9,6.6 60.2,12.7 66.8,27.43 36.58,40.64 33.02,40.89 30.48,38.61 29.97,35.56 32.51,34.54 35.81,35.05 36.83,37.85 34.04,37.34 31.24,44.2 26.16,37.59 54.1,13.72 54.36,16 51.82,12.19 54.86,30.99 52.58,28.07 41.4,42.42 41.4,41.66 1.52,18.29 7.62,23.37 8.64,1.27 62.99,2.79 52.07,5.33 46.74,1.27 35.31,3.81 62.99,18.29 57.15,26.67 58.42,29.46 56.64,39.12 65.28,44.45 45.97,38.35 53.59,37.08 10.92,43.18 20.07,43.94 16.76,39.12 10.41,35.31 16.76,35.56 19.56,28.19 26.67,14.73 38.1,11.43 42.42,5.33 62.74,22.61 65.02,22.1 61.98,25.4 61.21,26.67 50.8,25.91 51.56,23.62 44.2,17.02 61.09,44.22 63.75,41.15 34.8,26.42 34.8,25.15 36.07,25.65 33.27,24.38 27.43,20.07 25.65,3.05 67.56,19.05 63.25,13.46 65.79,16.26 64.52,9.65 16.51,18.29 20.07,17.27 20.57,20.83 49.53,17.27 39.62,15.75 42.93,17.02 60.71,32.26 60.96,25.65 47.24,28.96 46.23,9.14 59.94,22.61 61.01,21.87 60.2,21.59 60.71,29.72 58.42,27.94 51.82,25.91 50.8,22.61 45.47,17.02 46.74,17.02
  pour Top (isolate 0.305): -1.02,47.24 76.2,47.24 78.74,44.7 78.74,1.02 75.69,-2.03 0.76,-2.03 -2.54,1.27
  pour Bottom (isolate 0.254): 0.25,48.01 70.61,46.48 74.17,42.93 73.41,1.02 70.87,-1.52 0.76,-1.27 -3.05,2.54 -3.05,44.2 -1.78,45.47
LED1  (via drill 0.38)
  Top 0.254: v27.43,24.64 27.94,25.15 27.94,26.92 30.23,29.21 41.15,29.21 42.42,30.48 49.02,30.48 49.28,30.73 50.55,30.73 50.8,30.99 v50.8,31.5
  Bottom 0.254: IC1.16 50.06,30.71 50.04,30.73 50.29,30.73 50.8,31.24 v50.8,31.5 | v27.43,24.64 28.7,23.37 28.7,21.84 28.45,21.59 28.45,19.56 27.94,19.05 27.94,15.49 28.96,14.48 LED3.A
LED2  (via drill 0.38)
  Top 0.254: LED4.A 41.15,13.46 42.42,12.19 v42.42,11.94
  Bottom 0.254: v42.42,11.94 42.42,12.19 42.67,12.45 42.67,12.7 42.93,12.95 45.47,12.95 45.97,12.45 46.48,12.45 46.99,11.94 46.99,9.65 48.01,8.64 50.29,8.64 52.83,11.18 52.83,13.21 51.56,14.48 IC1.42
LED3  (via drill 0.38)
  Top 0.254: v26.16,26.42 26.67,26.92 26.67,27.18 29.72,30.23 40.64,30.23 41.91,31.5 48.51,31.5 49.53,32.51 51.31,32.51 51.82,32 51.82,30.99 50.55,29.72 v50.55,28.19
  Bottom 0.254: v26.16,26.42 25.4,25.65 25.4,23.11 24.89,22.61 23.62,22.61 22.35,21.34 22.35,17.02 20.83,15.49 LED2.A | IC1.17 50.56,28.44 v50.55,28.19
LED4
  Bottom 0.254: IC1.43 51.06,14.74 49.53,13.2 RN2.4
MISO
  Bottom 0.254: IC1.40 52.56,19.58 53.34,18.8 53.85,18.8 55.12,17.53 55.12,11.94 50.8,7.62 13.21,7.62 11.94,8.89 11.94,11.94 12.45,12.45 14.48,12.45 15.02,11.91 U2.2
MOSI
  Bottom 0.254: U2.3 12.95,10.6 12.95,8.64 13.46,8.13 50.55,8.13 53.34,10.92 53.34,13.46 52.06,14.74 IC1.41
N$1
  Bottom 1.27: X1.1 4.32,28.96 3.05,27.69 3.05,26.7 U2.9
N$3
  Bottom 0.305: Q1.3 32.3,25.4 33.02,25.4 33.53,25.91 33.53,27.18 33.91,27.56 35.43,27.56 37.34,29.46 40.86,29.46 R13.2
N$4  (via drill 0.38)
  Top 0.254: v49.78,14.99 59.18,14.99 v59.94,14.22
  Bottom 0.254: 50.04,15.24 v49.78,14.99 50.56,15.76 IC1.44 | R1.2 65.02,14.35 S3.1 65.02,14.61 65.02,14.73 63.75,16 60.71,16 59.94,15.24 v59.94,14.22
N$5  (via drill 0.38)
  Top 0.254: v27.43,21.34 27.69,21.59 28.19,21.59 28.7,22.1 28.7,22.35 29.97,23.62 29.97,24.13 v32.51,26.67
  Bottom 0.254: U3.10 36.49,29.63 35.05,28.19 32.51,28.19 32.26,27.94 32.26,26.92 v32.51,26.67 | v27.43,21.34 26.67,21.34 26.16,20.83 RN1.8
N$6
  Bottom 0.254: LED3.K 32.51,14.48 33.27,13.72 40.13,13.72 40.39,13.46 41.91,13.46 42.42,13.97 42.42,14.73 43.18,15.49 45.47,15.49 46.08,14.88 RN2.7
N$7
  Bottom 0.254: R16.1 52.51,38.39 IC3.5
N$8
  Bottom 0.254: C1.1 U1.8
N$9
  Bottom 0.254: C1.2 30.7,17.99 U1.7
N$10
  Bottom 0.254: RN2.6 45.61,14.08 45.21,14.48 LED4.K
N$11
  Bottom 0.254: LED2.K 22.86,13.97 22.86,10.92 23.62,10.16 26.67,10.16 27.18,10.67 27.18,12.7 27.69,13.21 39.88,13.21 40.13,12.95 42.16,12.95 42.67,13.46 45.97,13.46 46.23,13.2 RN2.5
N$12
  Bottom 0.254: U1.6 32,19.06 31.5,19.56 31.5,20.03 C4.1
N$13  (via drill 0.38)
  Top 0.254: v29.97,25.4 29.72,25.4 29.46,25.15 29.46,23.88 28.45,22.86 28.19,22.86 v27.94,22.61
  Bottom 0.254: U3.11 35.29,29.96 34.04,28.7 32,28.7 31.75,28.45 31.75,26.92 30.48,25.65 30.48,25.4 v29.97,25.4 | v27.94,22.61 27.69,22.35 27.18,22.35 26.92,22.1 26.67,22.1 25.29,20.72 RN1.7
N$14  (via drill 0.38)
  Top 0.254: v29.46,26.42 28.96,25.91 28.96,24.13 28.19,23.37 27.18,23.37 v26.92,23.11
  Bottom 0.254: U3.12 34.09,29.77 33.53,29.21 31.5,29.21 31.24,28.96 31.24,27.18 30.73,26.67 29.72,26.67 v29.46,26.42 | v26.92,23.11 24.49,20.68 RN1.6
N$15  (via drill 0.38)
  Top 0.254: LED7.A 23.75,2.41 24.64,3.3 24.64,9.91 24.89,10.16 25.15,10.16 25.91,10.92 v25.91,11.43
  Bottom 0.254: v25.91,11.43 25.4,11.94 25.4,15.75 26.16,16.51 26.16,17.18 26.17,17.19 RN1.1
N$16  (via drill 0.38)
  Top 0.254: 23.24,4.95 24.13,5.59 24.13,10.16 24.64,10.67 24.64,10.92 v24.89,11.18
  Bottom 0.254: v24.89,11.18 24.89,16 25.29,16.4 RN1.2
N$17  (via drill 0.38)
  Top 0.254: v23.88,11.18 23.88,10.67 23.62,10.41 23.62,7.71
  Bottom 0.254: v23.88,11.18 23.88,12.19 24.38,12.7 24.38,16.51 24.49,16.62 RN1.3
N$18
  cutout Top: 34.8,45.47 37.59,45.47 37.59,42.93 34.8,42.93
  cutout Bottom: 34.8,45.47 37.59,45.47 37.59,42.93 34.8,42.93
N$23  (via drill 0.38)
  Top 0.254: v55.37,34.8 55.12,34.54 48.51,34.54 47.5,33.53 45.97,33.53 v45.47,34.04
  Bottom 0.254: 55.63,34.54 v55.37,34.8 55.63,34.8 56.9,33.53 U1.A | v45.47,34.04 45.21,33.78 42.16,33.78 41.4,33.02
  Bottom 0.305: R13.1 40.77,31.11 41.15,31.5 41.15,32.77 42.16,33.78
N$26  (via drill 0.38)
  Top 0.254: v46.74,34.29 47.5,35.05 53.59,35.05 v55.37,36.83 | v62.48,30.99 61.98,31.62 61.98,34.42 v61.47,34.93
  Bottom 0.254: U$1.1A 70.36,29.4 69.6,30.16 69.6,33.27 69.34,33.53 69.34,34.54 68.33,35.56 67.31,35.56 66.55,34.8 64.26,34.8 63.75,35.31 63.25,35.31 62.74,34.8 61.72,34.8 61.6,34.93 v61.47,34.93 61.34,34.93 61.21,34.8 57.66,34.8 55.88,36.58 55.37,36.58 v55.37,36.83 | RN3.4 46.98,31.48 47.24,31.75 47.24,33.78 v46.74,34.29
  Bottom 0.406: Q2.1 61.91,31.09 D1.A v62.48,30.99
N$27
  Bottom 0.254: IC1.10 45.88,27.02 45.47,27.43 45.47,28.19 45.21,28.45 44.96,28.45 44.56,28.85 RN3.7 RN3.8
N$29  (via drill 0.38)
  Top 0.254: LED1.C 47.12,44.58 v46.86,44.32
  Bottom 0.254: IC3.1 46.67,38.93 45.72,39.88 45.72,43.18 v46.86,44.32
N$30
  Bottom 0.254: 47.46,25.02 IC1.6 44.66,25.02 R10.2
N$31
  Bottom 0.254: IC1.5 43.07,24.52 42.16,23.62 38.86,23.62 38.35,23.11 38.35,22.61 | 38.35,22.61 38.35,22.03 X2.1 | C6.2 38.19,22.77 38.35,22.61
N$32
  Bottom 0.254: R10.1 40.59,25.53 X2.3 40.52,27.13 C10.2
N$33  (via drill 0.38)
  Top 0.254: 69.34,34.54 69.34,33.02
  Top 0.406: v47.75,43.43 47.75,43.69
  Top 0.61: v47.75,42.67 v47.75,43.43 | v58.67,43.69 v58.67,42.93 58.42,43.18 48.26,43.18 47.75,43.69 | v69.34,36.07 69.34,33.02 68.26,31.94 U$1.2X
  Bottom 0.254: 58.56,38.1 J2.2 58.56,40.02
  Bottom 0.406: v58.67,43.69 58.67,40.64 58.67,38.21 58.56,38.1 | 58.56,40.28 58.84,40.28 U$3.1
  Bottom 0.61: 48.01,43.18 v47.75,43.43 | 58.56,40.02 58.56,40.28 | v69.34,36.07 68.71,36.45 67.94,36.45 66.55,37.34 64.52,37.34 62.99,38.86 62.99,39.88 60.96,42.16 59.44,42.16 58.67,40.64 | IC3.3 49.34,40.83 48.26,41.91 47.54,41.91 C14.2 47.75,42.12 v47.75,42.67
N$34  (via drill 0.38)
  Top 0.254: LED1.A 53.17,44.58 v53.43,44.32
  Bottom 0.254: v53.43,44.32 R17.2
N$35
  Bottom 0.254: JP3.VCC 67.6,24.16 D4.C
  Bottom 0.406: L1.2 66.76,25.06 D4.C
NSS
  Bottom 0.2: 54.73,26.02 54.36,25.65 | 55.37,20.32 55.32,20.32 54.61,21.03 54.61,21.08
  Bottom 0.254: 54.61,21.08 54.61,21.84 54.36,22.1 54.36,25.65 | U2.5 9.14,10.54 9.14,9.14 11.68,6.6 53.09,6.6 55.88,9.4 56.64,9.4 57.66,10.41 57.66,10.92 57.15,11.43 57.15,18.54 55.37,20.32 | IC1.29 54.73,26.02
P_RST  (via drill 0.38)
  Top 0.254: v7.62,8.64 17.78,8.64 v18.29,9.14 | v43.69,20.32 42.93,20.32 40.64,18.03 39.65,18.03 U1.1 39.5,17.4 38.1,16 38.1,13.97 v36.58,12.45
  Bottom 0.254: IC1.2 44.87,23.02 43.94,22.1 43.94,20.83 v43.69,20.32 | U2.6 7.02,9.24 v7.62,8.64 | v18.29,9.14 18.8,8.64 37.85,8.64 38.1,8.89 38.1,9.65 36.83,10.92 36.83,11.68 36.58,11.94 v36.58,12.45
R_INT  (via drill 0.38)
  Top 0.254: v49.78,3.81 v49.78,1.78 | v18.54,25.15 v18.54,21.59 | v19.56,9.4 19.56,9.14 18.54,8.13 v18.54,5.84 | v53.59,22.61 56.9,22.61 57.53,21.97 v57.53,20.95
  Bottom 0.254: IC1.28 54.46,26.52 53.85,25.91 53.85,22.86 v53.59,22.61 | v49.78,3.81 50.8,3.81 52.58,2.03 58.93,2.03 59.69,2.79 59.69,8.38 59.18,8.89 59.18,10.92 58.17,11.94 58.17,15.49 58.42,15.75 58.93,15.75 59.94,16.76 59.94,18.54 58.93,19.56 58.42,19.56 57.53,20.45 v57.53,20.95 | v49.78,1.78 49.53,1.78 49.28,2.03 19.3,2.03 18.54,2.79 v18.54,5.84 | U2.14 13.02,27.5 13.97,28.45 18.03,28.45 18.54,27.94 v18.54,25.15 | v18.54,21.59 18.54,10.41 v19.56,9.4
ROT_A  (via drill 0.38)
  Top 0.254: v53.09,23.62 53.09,23.37 52.83,23.11 52.83,22.1 53.09,21.84 56.39,21.84 v56.64,21.59
  Bottom 0.254: SW1.B 59.18,4.06 59.18,8.13 58.67,8.64 58.67,10.67 57.66,11.68 57.66,15.75 58.17,16.26 58.67,16.26 59.44,17.02 59.44,18.29 58.67,19.05 58.17,19.05 56.39,20.83 56.39,21.84 v56.64,21.59 | IC1.27 54.2,27.02 53.34,26.16 53.34,23.88 v53.09,23.62
ROT_B  (via drill 0.38)
  Top 0.254: v53.34,8.13 53.34,3.3 SW1.A
  Bottom 0.254: 53.34,3.3 SW1.A | IC1.38 53.56,20.1 53.85,19.81 54.36,19.81 56.13,18.03 56.13,11.43 53.34,8.64 v53.34,8.13
ROT_M  (via drill 0.38)
  Top 0.254: v52.07,22.61 52.07,22.1 52.83,21.34 55.37,21.34 v55.63,21.08
  Bottom 0.254: IC1.26 53.94,27.52 52.83,26.42 52.83,24.64 52.32,24.13 52.32,22.86 v52.07,22.61 | SW1.SW+ 58.29,18.16 55.63,20.83 v55.63,21.08
RST  (via drill 0.38)
  Top 0.254: v24.38,23.88 27.94,23.88 28.45,24.38 28.45,26.67 28.96,27.18 30.73,27.18 31.75,28.19 40.13,28.19 40.64,27.69 40.64,26.92 40.89,26.67 46.74,26.67 v48.77,24.64 | v37.08,9.4 v37.08,5.84
  Bottom 0.254: IC1.7 48.14,25.52 48.77,24.89 v48.77,24.64 | v37.08,5.84 37.08,4.57 38.61,3.05 50.8,3.05 52.32,1.52 59.18,1.52 60.2,2.54 60.2,8.64 59.69,9.14 59.69,11.18 58.67,12.19 58.67,14.99 58.93,15.24 59.18,15.24 60.45,16.51 63.75,16.51 64.77,17.53 70.61,17.53 J1.10 | v37.08,9.4 36.83,9.14 22.61,9.14 22.35,9.4 19.56,12.45 19.56,14.99 21.84,17.27 21.84,21.59 23.37,23.11 24.13,23.11 24.38,23.37 v24.38,23.88
SCL
  Bottom 0.254: IC1.45 50.06,19.07 49.02,18.03 41.66,18.03 40.13,16.51 38.65,16.51 R4.2 38,16.57 U1.2 37.97,18.21
SCLK
  Bottom 0.254: U2.4 11.18,10.51 11.18,8.64 12.7,7.11 51.05,7.11 55.63,11.68 55.63,17.78 54.1,19.3 53.59,19.3 53.06,19.84 IC1.39
SDA
  Bottom 0.254: IC1.46 49.56,19.33 48.77,18.54 41.4,18.54 40.13,19.81 36.83,19.81 36.58,19.56 36.58,18.29 | 36.58,18.29 36.07,17.78 36.07,16.47 R5.2 | 36.58,18.29 36.58,18.27 U1.3
SW1  (via drill 0.38)
  Top 0.254: v43.18,19.3 42.67,19.3 41.91,18.54 41.91,16.76 40.13,14.99 40.13,11.41 S2.3
  Bottom 0.254: 40.16,10.95 S2.3 40.13,11.35 40.13,10.16 41.66,8.64 | IC1.3 44.61,23.52 43.43,22.35 43.43,21.34 42.67,20.57 42.67,19.81 v43.18,19.3
SW2  (via drill 0.38)
  Top 0.254: v26.92,25.65 27.43,26.16 27.43,27.18 29.97,29.72 40.89,29.72 42.16,30.99 48.77,30.99 49.28,31.5 v49.78,31.5
  Bottom 0.254: IC1.15 49.56,31.27 v49.78,31.5 | S1.3 28.73,10.69 27.69,9.65 23.37,9.65 22.1,10.92 22.1,16 22.86,16.76 22.86,21.08 23.88,22.1 25.15,22.1 25.91,22.86 25.91,24.64 v26.92,25.65
SWCLK  (via drill 0.38)
  Top 0.254: v56.64,10.67 59.44,8.13 65.53,8.13 67.06,9.65 69.6,9.65 v69.85,9.91
  Bottom 0.254: 56.6,11.22 56.64,11.18 | IC1.37 54.06,20.87 56.64,18.29 56.64,11.18 | v56.64,10.67 56.39,10.41 56.39,10.92 56.64,11.18 | J1.4 70.36,12.45 69.98,12.07 69.98,10.03 v69.85,9.91
SWDAT  (via drill 0.38)
  Top 0.254: v72.39,17.53 72.9,17.02 72.9,10.41 v72.39,9.91
  Bottom 0.254: IC1.34 60.55,23.52 64.01,20.07 64.01,18.8 64.77,18.03 71.88,18.03 v72.39,17.53 | v72.39,9.91 72.39,10.67 J1.2
USART1_RX  (via drill 0.38)
  Top 0.254: v55.12,33.27 54.36,34.04 48.77,34.04 47.75,33.02 44.2,33.02 43.69,33.53 42.16,33.53 41.4,32.77 41.4,32.51 40.13,31.24 28.7,31.24 v26.16,28.7
  Bottom 0.254: JP2.3 15.75,30.73 16.76,29.72 25.15,29.72 v26.16,28.7 | IC1.31 58.8,25.02 59.94,26.16 59.94,31.75 59.18,32.51 55.88,32.51 v55.12,33.27 55.37,33.53
USART1_TX  (via drill 0.38)
  Top 0.254: v25.91,27.43 25.91,27.18 29.46,30.73 40.39,30.73 41.91,32.26 41.91,32.51 42.42,33.02 43.43,33.02 43.94,32.51 48.01,32.51 49.02,33.53 53.59,33.53 v54.86,32.26
  Bottom 0.254: JP2.2 13.21,31.5 15.49,29.21 24.13,29.21 v25.91,27.43 25.65,27.69 | IC1.30 58.54,25.52 59.44,26.42 59.44,31.5 58.93,32 55.12,32 v54.86,32.26
USART2_RX
  Bottom 0.229: 48.56,34.5 47.5,35.56
  Bottom 0.254: U3.5 38.87,36.58 39.88,36.58 41.4,35.05 44.45,35.05 44.96,35.56 47.5,35.56 | IC1.13 48.56,34.5
USART2_TX
  Bottom 0.254: U3.6 40.19,35.51 41.15,34.54 44.7,34.54 45.21,35.05 47.24,35.05 48.01,34.29 48.01,28.45 47.58,28.02 IC1.12
VBAT_S  (via drill 0.38)
  Top 0.254: v42.93,32.26 43.18,32 48.26,32 49.28,33.02 52.83,33.02 v53.85,32
  Bottom 0.254: 66.55,32.26 63.5,32.26 62.74,33.02 56.64,33.02 55.63,34.04 54.36,34.04 53.85,33.53 v53.85,32 | RN3.1 43.45,31.48 42.93,32 v42.93,32.26
  Bottom 0.406: 66.29,29.46 67.63,29.46 U$1.2A | 66.29,29.46 66.29,32 66.55,32.26 | Q2.3 63.92,27.35 65.28,28.7 65.28,29.21 65.53,29.46 66.29,29.46
VBUS  (via drill 0.38)
  Top 0.406: v62.36,35.56 62.61,35.31 62.61,32.13 64.26,30.48 65.79,30.48 66.04,30.73 v68.83,30.73
  Top 0.61: U$1.1X 70.3,31.94 69.09,30.73 v68.83,30.73
  Bottom 0.305: 61.34,35.81 60.96,35.56 60.45,35.56
  Bottom 0.406: C16.2 52.32,41.91 | 52.32,41.91 53.55,41.91 R17.1 54.36,41.7 54.36,41.4 55.37,40.39 55.37,38.35 57.4,36.32 57.4,35.81 57.66,35.56 60.45,35.56 | IC3.4 51.97,41.56 52.32,41.91 | 61.34,35.81 62.1,35.81 v62.36,35.56 | L1.1 65.53,27.69 66.12,28.27 68.15,28.27 68.83,28.96 v68.83,30.73
VIN_S  (via drill 0.38)
  Top 0.406: v24.89,26.67 24.89,28.7 28.19,32 38.35,32 39.37,33.02 39.37,34.29 40.13,35.05 40.89,35.05 41.15,35.31 43.69,35.31 44.45,36.07 45.47,36.07 v46.74,37.34 | v63.5,34.42 63.5,34.29 63.25,34.04 63.25,32.77 64.01,32 64.77,32 v65.28,31.5
  Bottom 0.254: 60.96,34.16 61.98,34.16
  Bottom 0.406: IC2.3 22.86,27.9 C8.2 24.42,27.65 24.89,27.18 v24.89,26.67 | 63.37,34.16 v63.5,34.42 63.25,34.16 61.98,34.16 | v46.74,37.34 47.24,37.34 47.5,37.59 51.56,37.59 53.34,35.81 55.63,35.81 57.28,34.16 60.96,34.16 | 65.28,31.24 v65.28,31.5 65.02,31.24 D1.C 63.82,31.09 Q2.2
  Bottom 0.61: 43.56,38.14 43.56,37.72 43.94,37.34 v46.74,37.34
  Bottom 1.016: IC4.3 43.56,38.14 C13.2
WAKE  (via drill 0.38)
  Top 0.254: v30.48,28.19 30.99,28.7 41.4,28.7 42.67,29.97 48.51,29.97 48.77,29.72 v48.77,27.94
  Bottom 0.254: IC1.14 49.06,28.41 v48.77,27.94 | v30.48,28.19 30.48,30.59 U3.15
WAKE_SW  (via drill 0.38)
  Top 0.254: v49.78,35.81 49.02,36.58 46.99,36.58 45.72,35.31 44.7,35.31 43.94,34.54 41.4,34.54 40.89,34.04 v40.39,34.04
  Bottom 0.254: v49.78,35.81 49.78,33.27 50.04,33.02 51.56,33.02 52.32,32.26 52.32,31.24 53.06,30.51 IC1.22 | U3.7 40.12,34.31 v40.39,34.04
(copper drawn outside any net)
  shapes: Bottom area x1

### Text on the board
tPlace: ON | OK | TELEM / STATUS | LINK | PRESET | MENU
bPlace: BOOT | SWD | Matt Brejza | LoRa Basestation | Sept 14 | ©